# Altium schematic sheet CommonBoard_FK_H743_out.SchDoc
size A3
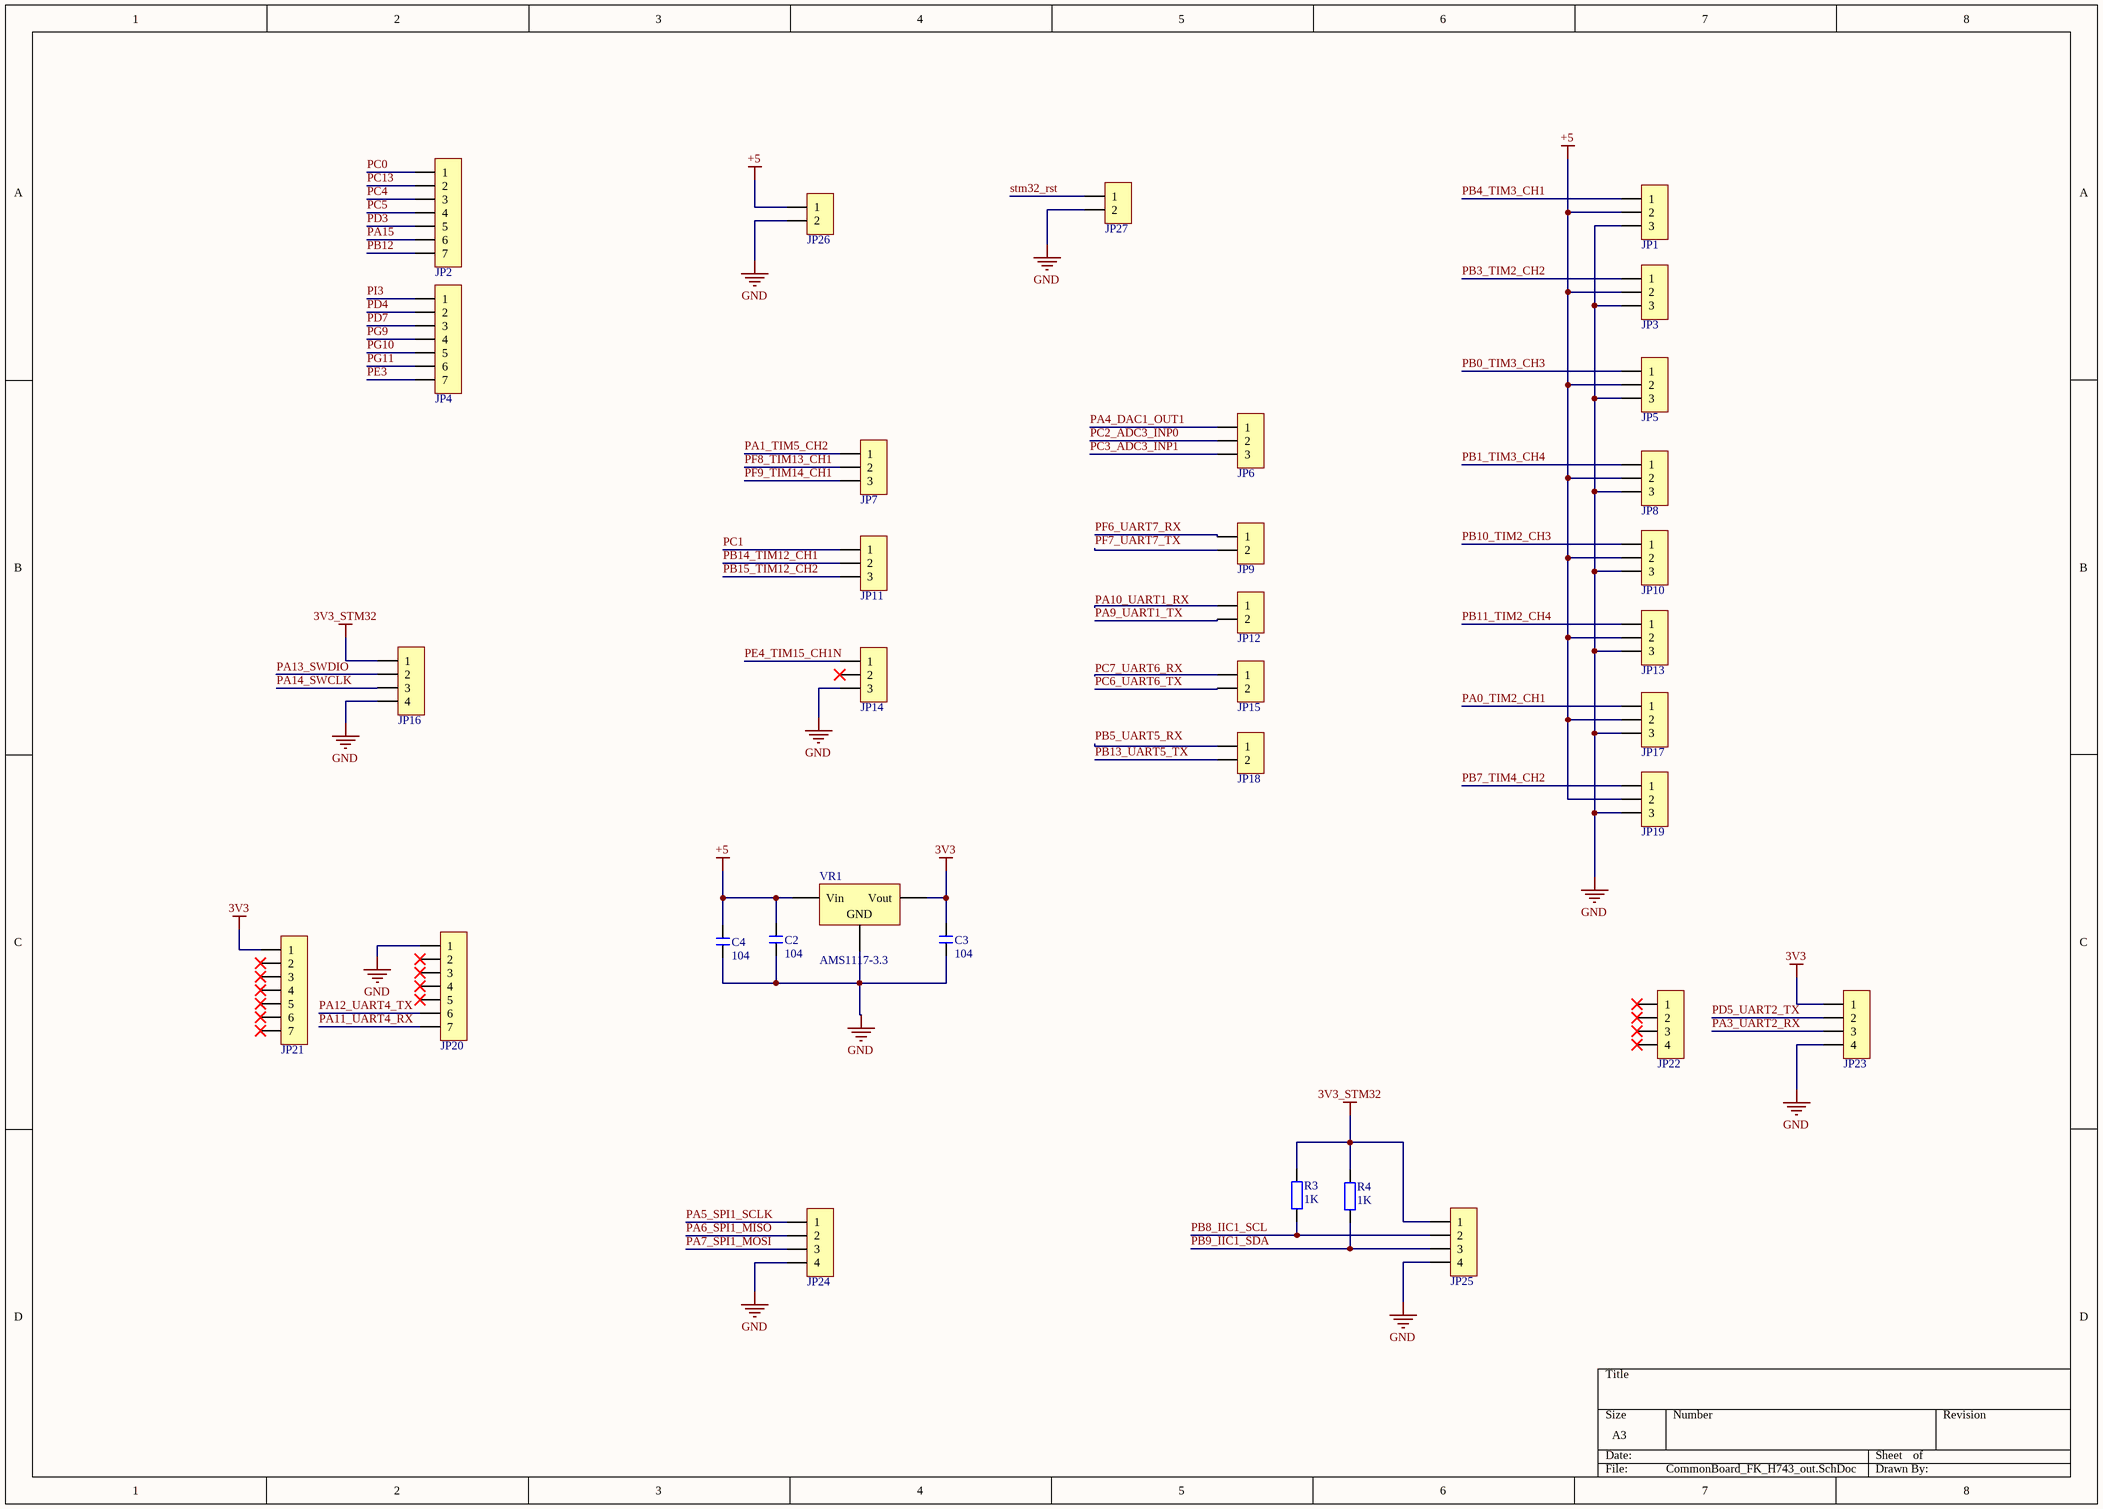
[diagram p0: CommonBoard_FK_H743_out.SchDoc]

## Parts
C2  104  [C 0603_L]
C3  104  [C 0603_L]
C4  104  [C 0603_L]
JP1  HDR-1X3  [HDR2.54-LI-3P]  (value not drawn)
JP2  HDR-1X7  [HDR2.54-LI-7P]  (value not drawn)
JP3  HDR-1X3  [HDR2.54-LI-3P]  (value not drawn)
JP4  HDR-1X7  [HDR2.54-LI-7P]  (value not drawn)
JP5  HDR-1X3  [HDR2.54-LI-3P]  (value not drawn)
JP6  HDR-1X3  [HDR2.54-LI-3P]  (value not drawn)
JP7  HDR-1X3  [HDR2.54-LI-3P]  (value not drawn)
JP8  HDR-1X3  [HDR2.54-LI-3P]  (value not drawn)
JP9  HDR-1X2  [HDR2.54-LI-2P]  (value not drawn)
JP10  HDR-1X3  [HDR2.54-LI-3P]  (value not drawn)
JP11  HDR-1X3  [HDR2.54-LI-3P]  (value not drawn)
JP12  HDR-1X2  [HDR2.54-LI-2P]  (value not drawn)
JP13  HDR-1X3  [HDR2.54-LI-3P]  (value not drawn)
JP14  HDR-1X3  [HDR2.54-LI-3P]  (value not drawn)
JP15  HDR-1X2  [HDR2.54-LI-2P]  (value not drawn)
JP16  HDR-1X4  [HDR2.54-LI-4P]  (value not drawn)
JP17  HDR-1X3  [HDR2.54-LI-3P]  (value not drawn)
JP18  HDR-1X2  [HDR2.54-LI-2P]  (value not drawn)
JP19  HDR-1X3  [HDR2.54-LI-3P]  (value not drawn)
JP20  HDR-1X7  [HDR2.54-LI-7P]  (value not drawn)
JP21  HDR-1X7  [HDR2.54-LI-7P]  (value not drawn)
JP22  HDR-1X4  [HDR2.54-LI-4P]  (value not drawn)
JP23  HDR-1X4  [HDR2.54-LI-4P]  (value not drawn)
JP24  HDR-1X4  [HDR2.54-LI-4P]  (value not drawn)
JP25  HDR-1X4  [HDR2.54-LI-4P]  (value not drawn)
JP26  HDR-1X2  [KF128-3.81-2P]  (value not drawn)
JP27  HDR-1X2  [HDR2.54-LI-2P]  (value not drawn)
R3  1K  [R 0603_L]
R4  1K  [R 0603_L]
VR1  AMS1117-3.3  [SOT-223]

## Nets
3V3: C3.2 JP21.1 JP23.1 VR1.2(Vout)
3V3_STM32: JP16.1 JP25.1 R3.1 R4.1
+5: C2.2 C4.2 JP1.2 JP3.2 JP5.2 JP8.2 JP10.2 JP13.2 JP17.2 JP19.2 JP26.1 VR1.3(Vin)
GND: C2.1 C3.1 C4.1 JP1.3 JP3.3 JP5.3 JP8.3 JP10.3 JP13.3 JP14.3 JP16.4 JP17.3 JP19.3 JP20.1 JP23.4 JP24.4 JP25.4 JP26.2 JP27.2 VR1.1(GND)
PA0_TIM2_CH1: JP17.1
PA1_TIM5_CH2: JP7.1
PA3_UART2_RX: JP23.3
PA4_DAC1_OUT1: JP6.1
PA5_SPI1_SCLK: JP24.1
PA6_SPI1_MISO: JP24.2
PA7_SPI1_MOSI: JP24.3
PA9_UART1_TX: JP12.2
PA10_UART1_RX: JP12.1
PA11_UART4_RX: JP20.7
PA12_UART4_TX: JP20.6
PA13_SWDIO: JP16.2
PA14_SWCLK: JP16.3
PA15: JP2.6
PB0_TIM3_CH3: JP5.1
PB1_TIM3_CH4: JP8.1
PB3_TIM2_CH2: JP3.1
PB4_TIM3_CH1: JP1.1
PB5_UART5_RX: JP18.1
PB7_TIM4_CH2: JP19.1
PB8_IIC1_SCL: JP25.2 R3.2
PB9_IIC1_SDA: JP25.3 R4.2
PB10_TIM2_CH3: JP10.1
PB11_TIM2_CH4: JP13.1
PB12: JP2.7
PB13_UART5_TX: JP18.2
PB14_TIM12_CH1: JP11.2
PB15_TIM12_CH2: JP11.3
PC0: JP2.1
PC1: JP11.1
PC2_ADC3_INP0: JP6.2
PC3_ADC3_INP1: JP6.3
PC4: JP2.3
PC5: JP2.4
PC6_UART6_TX: JP15.2
PC7_UART6_RX: JP15.1
PC13: JP2.2
PD3: JP2.5
PD4: JP4.2
PD5_UART2_TX: JP23.2
PD7: JP4.3
PE3: JP4.7
PE4_TIM15_CH1N: JP14.1
PF6_UART7_RX: JP9.1
PF7_UART7_TX: JP9.2
PF8_TIM13_CH1: JP7.2
PF9_TIM14_CH1: JP7.3
PG9: JP4.4
PG10: JP4.5
PG11: JP4.6
PI3: JP4.1
stm32_rst: JP27.1

Not connected (* = marked no-connect by the designer): JP14 2*; JP20 2* 3* 4* 5*; JP21 2* 3* 4* 5* 6* 7*; JP22 1* 2* 3* 4*

## Library data of the parts
C2-C4 = C: 无极性贴片电容; 版权归属: 源创客; BOM名称: 无极性贴片电容; 学习资源: www.ooocke.com
JP1 JP3 JP5-JP8 JP10 JP11 JP13 JP14 JP17 JP19 = Header 3: 3P接插件; 版权归属: 源创客; BOM名称: 3P接插件; 学习资源: www.ooocke.com
JP2 JP4 JP20 JP21 = Header 7: 7P接插件; 版权归属: 源创客; BOM名称: 7P接插件; 学习资源: www.ooocke.com
JP9 JP12 JP15 JP18 JP26 JP27 = Header 2: 2P接插件; 版权归属: 源创客; BOM名称: 2P接插件; 学习资源: www.ooocke.com
JP16 JP22-JP25 = Header 4: 4P接插件; 版权归属: 源创客; BOM名称: 4P接插件; 学习资源: www.ooocke.com
R3 R4 = R: 贴片电阻; 版权归属: 源创客; BOM名称: 贴片电阻; 学习资源: www.ooocke.com
VR1 = SOT-223 AMS1117-3.3: 低压差线性稳压(LDO); ComponentLink1Description: 供应商链接; ComponentLink1URL: http://www.szlcsc.com/product/details_6652.html; Package: SOT-223; Supplier: LC; SuppliersPartNumber: C6186